# Altium schematic sheet EXPANSION_BOARD.SchDoc
size Tabloid; SheetNumber: 1; SheetTotal: 1; SPICEModelCacheOXJGALYG: <root> / <DocumentId>OXJGALYG</DocumentId> / <CacheFrame Number="0"> / <Model Name="0603_150060bs75003" Kind="CKT"> / <Text>****** / .subckt 0603_150060BS75003  1  2 / D1 1 2 SMCW / .MODEL SMCW D / + IS=695.94E-6 / + N=5 / + RS=2.4677 / + IKF=16.109E-12 / + CJO=1.0000E-12 / + M=.3333 / + VJ=.75 / + BV=5 / + IBV=10.00E-6 / + TT=5.0000E-9 / .ends</Text> / </Model> / <Model Name="0603_150060ys73220" Kind="CKT"> / <Text>********************************* / .subckt 0603_150060YS73220 1 2 / D1 1 2 SMCC / .MODEL SMCC D / + IS=405.27E-18 / + N=2.1772 / + RS=.76388 / + IKF=194.19E-6 / + CJO=1.0000E-12 / + M=.3333 / + VJ=.75 / + BV=5 / + IBV=100.00E-6 / + TT=5.0000E-9 / .ends</Text> / </Model> / <Model Name="0603_150060rs75003" Kind="CKT"> / <Text>****** / .subckt 0603_150060RS75003  1  2 / D1 1 2 SMCW / .MODEL SMCW D / + IS=1.0025E-15 / + N=2.2259 / + RS=.3926 / + IKF=240.91E-6 / + CJO=1.0000E-12 / + M=.3333 / + VJ=.75 / + BV=5 / + IBV=10.00E-6 / + TT=5.0000E-9 / .ends</Text> / </Model> / </CacheFrame> / </root>
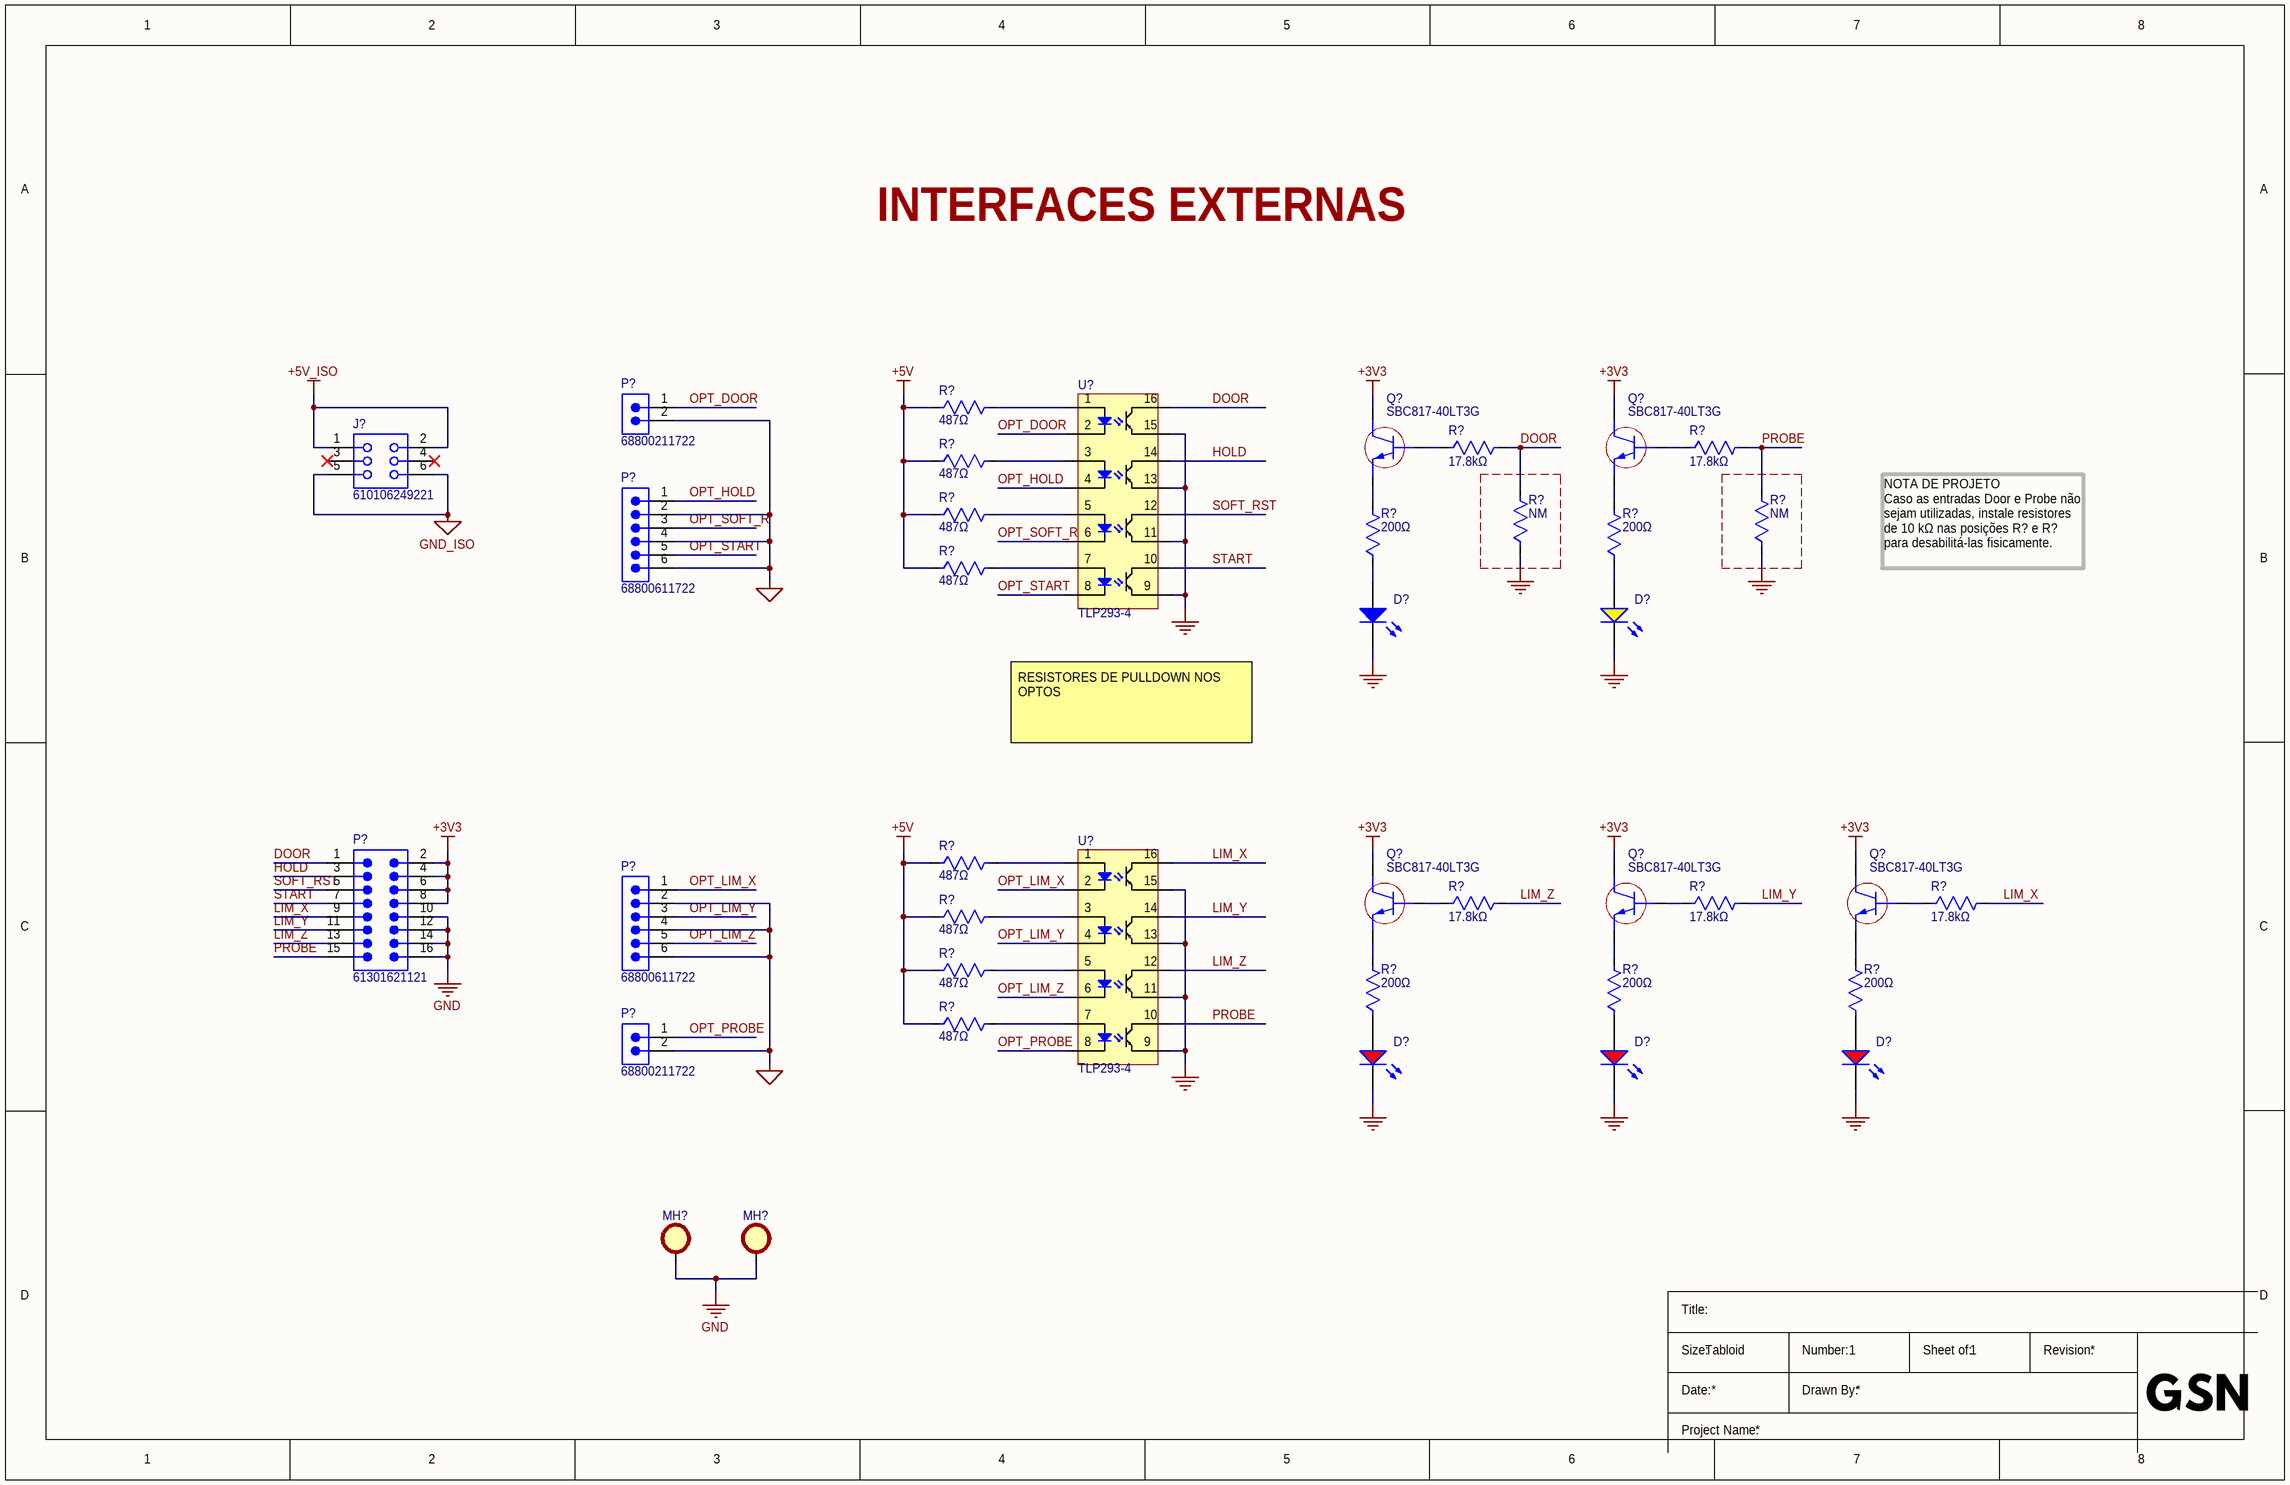
[diagram p0: EXPANSION_BOARD.SchDoc]

## Parts
(Parts that share a designator on the sheet are numbered #1, #2 ... from top to bottom, then left to right.)
D?#1  Blue, 3.2V, 140°  [WL-SMCW_0603_150060xx75003]  (value not drawn)
D?#2  Yellow, 2V, 120°  [WL-SMCC_0603_150060xx73220]  (value not drawn)
D?#3  Red, 2V, 140°  [WL-SMCW_0603_150060xx75003]  (value not drawn)
D?#4  Red, 2V, 140°  [WL-SMCW_0603_150060xx75003]  (value not drawn)
D?#5  Red, 2V, 140°  [WL-SMCW_0603_150060xx75003]  (value not drawn)
J?  610106249221  [610106249221]
MH?#1  Mounting Hole 2.5mm  [MOUNTING_HOLE_M2P5_PLATED]  (value not drawn)  (no BOM)
MH?#2  Mounting Hole 2.5mm  [MOUNTING_HOLE_M2P5_PLATED]  (value not drawn)  (no BOM)
P?#1  68800211722  [68800211722]
P?#2  68800611722  [68800611722]
P?#3  61301621121  [61301621121]
P?#4  68800611722  [68800611722]
P?#5  68800211722  [68800211722]
Q?#1  SBC817-40LT3G  [SOT-23-3]
Q?#2  SBC817-40LT3G  [SOT-23-3]
Q?#3  SBC817-40LT3G  [SOT-23-3]
Q?#4  SBC817-40LT3G  [SOT-23-3]
Q?#5  SBC817-40LT3G  [SOT-23-3]
R?#1  487Ω  [0603-REFLOW]
R?#2  17.8kΩ  [0603-WAVE]
R?#3  17.8kΩ  [0603-WAVE]
R?#4  487Ω  [0603-REFLOW]
R?#5  487Ω  [0603-REFLOW]
R?#6  NM  [0805-REFLOW]
R?#7  NM  [0805-REFLOW]
R?#8  487Ω  [0603-REFLOW]
R?#9  200Ω  [0603-REFLOW]
R?#10  200Ω  [0603-REFLOW]
R?#11  487Ω  [0603-REFLOW]
R?#12  17.8kΩ  [0603-WAVE]
R?#13  17.8kΩ  [0603-WAVE]
R?#14  17.8kΩ  [0603-WAVE]
R?#15  487Ω  [0603-REFLOW]
R?#16  487Ω  [0603-REFLOW]
R?#17  487Ω  [0603-REFLOW]
R?#18  200Ω  [0603-REFLOW]
R?#19  200Ω  [0603-REFLOW]
R?#20  200Ω  [0603-REFLOW]
U?#1  TLP293-4  [SO-16]
U?#2  TLP293-4  [SO-16]

## Nets
+3V3: P?#3.2 P?#3.4 P?#3.6 P?#3.8 Q?#1.3(C) Q?#2.3(C) Q?#3.3(C) Q?#4.3(C) Q?#5.3(C)
+5V: R?#1.1 R?#4.1 R?#5.1 R?#8.1 R?#11.1 R?#15.1 R?#16.1 R?#17.1
+5V_ISO: J?.1 J?.2
GND: D?#1.2(K) D?#2.1(K) D?#3.2(K) D?#4.2(K) D?#5.2(K) MH?#1.H MH?#2.H P?#3.10 P?#3.12 P?#3.14 P?#3.16 R?#6.1 R?#7.1 U?#1.9 U?#1.11 U?#1.13 U?#1.15 U?#2.9 U?#2.11 U?#2.13 U?#2.15
GND_ISO: J?.5 J?.6 P?#1.2 P?#2.2 P?#2.4 P?#2.6 P?#4.2 P?#4.4 P?#4.6 P?#5.2
DOOR: P?#3.1 R?#2.2 R?#6.2 U?#1.16
HOLD: P?#3.3 U?#1.14
LIM_X: P?#3.9 R?#14.2 U?#2.16
LIM_Y: P?#3.11 R?#13.2 U?#2.14
LIM_Z: P?#3.13 R?#12.2 U?#2.12
OPT_DOOR: P?#1.1 U?#1.2
OPT_HOLD: P?#2.1 U?#1.4
OPT_LIM_X: P?#4.1 U?#2.2
OPT_LIM_Y: P?#4.3 U?#2.4
OPT_LIM_Z: P?#4.5 U?#2.6
OPT_PROBE: P?#5.1 U?#2.8
OPT_SOFT_R: P?#2.3 U?#1.6
OPT_START: P?#2.5 U?#1.8
PROBE: P?#3.15 R?#3.2 R?#7.2 U?#2.10
SOFT_RST: P?#3.5 U?#1.12
START: P?#3.7 U?#1.10
NetD?#1_1: D?#1.1(A) R?#9.1
NetD?#2_2: D?#2.2(A) R?#10.1
NetD?#3_1: D?#3.1(A) R?#18.1
NetD?#4_1: D?#4.1(A) R?#19.1
NetD?#5_1: D?#5.1(A) R?#20.1
NetQ?#1_1: Q?#1.1(B) R?#2.1
NetQ?#1_2: Q?#1.2(E) R?#9.2
NetQ?#2_1: Q?#2.1(B) R?#3.1
NetQ?#2_2: Q?#2.2(E) R?#10.2
NetQ?#3_1: Q?#3.1(B) R?#12.1
NetQ?#3_2: Q?#3.2(E) R?#18.2
NetQ?#4_1: Q?#4.1(B) R?#13.1
NetQ?#4_2: Q?#4.2(E) R?#19.2
NetQ?#5_1: Q?#5.1(B) R?#14.1
NetQ?#5_2: Q?#5.2(E) R?#20.2
NetR?#1_2: R?#1.2 U?#1.1
NetR?#4_2: R?#4.2 U?#1.3
NetR?#5_2: R?#5.2 U?#1.5
NetR?#8_2: R?#8.2 U?#1.7
NetR?#11_2: R?#11.2 U?#2.1
NetR?#15_2: R?#15.2 U?#2.3
NetR?#16_2: R?#16.2 U?#2.5
NetR?#17_2: R?#17.2 U?#2.7

Not connected (* = marked no-connect by the designer): J? 3* 4*

## Notes on the sheet
- INTERFACES EXTERNAS
- NOTA DE PROJETO
  Caso as entradas Door e Probe não sejam utilizadas, instale resistores de 10 kΩ nas posições R? e R? para desabilitá-las fisicamente.
- RESISTORES DE PULLDOWN NOS OPTOS
- Title:
- Size:
- Tabloid
- Number:
- Sheet of:
- Revision:
- Date:
- Project Name:
- Drawn By:

## Library data of the parts
D?#1 = 150060BS75003: WL-SMCW Mono-color Chip LED Waterclear, SMT, size 0603, Blue, 3.2V, 140°; Manufacturer: Wurth Elektronik; Case/Size Code: 0603; Chip Technology: InGaN; Dominant Wavelength: 470nm; Luminous Intensity: 350mcd; Peak Wavelength: 465nm; Manufacturer Part Number: 150060BS75003; Category: Signal LEDs; Match Code: WL-SMCW; ComponentLink1Description: Website Link; ComponentLink1URL: https://www.we-online.com/redexpert/article/150060BS75003?ad; ComponentLink2Description: Datasheet Link; ComponentLink2URL: https://www.we-online.com/redexpert/spec/150060BS75003?ad; Mount: Surface Mount; Min Operating Temperature: -40°C; Max Operating Temperature: 100°C; Packaging: Tape and Reel; Length: 1.6mm; Width: 0.8mm; Height: 0.7mm; Emitting Color: Blue; Forward Voltage: 3.2V; Viewing Angle: 140°
D?#2 = 150060YS73220: WL-SMCC Mono-color Chip LED Compact, SMT, size 0603, Yellow, 2V, 120°; Manufacturer: Wurth Elektronik; Case/Size Code: 0603; Chip Technology: AlInGaP; Dominant Wavelength: 589nm; Luminous Intensity: 100mcd; Peak Wavelength: 591nm; Manufacturer Part Number: 150060YS73220; Category: Signal LEDs; Match Code: WL-SMCC; ComponentLink1Description: Website Link; ComponentLink1URL: https://www.we-online.com/redexpert/article/150060YS73220?ad; ComponentLink2Description: Datasheet Link; ComponentLink2URL: https://www.we-online.com/redexpert/spec/150060YS73220?ad; Mount: Surface Mount; Min Operating Temperature: -40°C; Max Operating Temperature: 85°C; Packaging: Tape and Reel; Length: 1.6mm; Width: 0.8mm; Height: 0.2mm; Emitting Color: Yellow; Forward Voltage: 2V; Viewing Angle: 120°
D?#3-D?#5 = 150060RS75003: WL-SMCW Mono-color Chip LED Waterclear, SMT, size 0603, Red, 2V, 140°; Manufacturer: Wurth Elektronik; Case/Size Code: 0603; Chip Technology: AlInGaP; Dominant Wavelength: 625nm; Luminous Intensity: 530mcd; Peak Wavelength: 630nm; Manufacturer Part Number: 150060RS75003; Category: Signal LEDs; Match Code: WL-SMCW; ComponentLink1Description: Website Link; ComponentLink1URL: https://www.we-online.com/redexpert/article/150060RS75003?ad; ComponentLink2Description: Datasheet Link; ComponentLink2URL: https://www.we-online.com/redexpert/spec/150060RS75003?ad; Mount: Surface Mount; Min Operating Temperature: -40°C; Max Operating Temperature: 100°C; Packaging: Tape and Reel; Length: 1.6mm; Width: 0.8mm; Height: 0.7mm; Emitting Color: Red; Forward Voltage: 2V; Viewing Angle: 140°
J? = 610106249221: WR-PHD Socket Header, SMT, Angled, pitch 2.54mm, 2 Row, 6P; Manufacturer: Wurth Elektronik; Contact Resistance: 20mOhm; Rated Current: 3A; Working Voltage: 250V; Withstanding Voltage: 600V; Manufacturer Part Number: 610106249221; Category: Board-to-Board Connectors; Match Code: WR-PHD; ComponentLink1Description: Website Link; ComponentLink1URL: https://www.we-online.com/redexpert/article/610106249221?ad; ComponentLink2Description: Datasheet Link; ComponentLink2URL: https://www.we-online.com/redexpert/spec/610106249221?ad; Mount: Surface Mount; Operating Temperature Min: -40degC; Operating Temperature Max: 105degC; Packaging: Tape and Reel; Gender: Socket Header; Number of Pins: 6; Number of Rows: 2; Orientation: Angled; Lead Pitch: 2.54mm
MH?#1 MH?#2 = MTH-2P5MM-PLATED: PLATED MOUNTING HOLE WITH 2.5MM DIAMETER
P?#1 P?#5 = 68800211722: WR-WTB “J” Type THT Male Horizontal Shrouded Header, pitch 2.5 mm, 2 pins; Manufacturer: Wurth Elektronik; Contact Resistance: 20 mohm; Rated Current: 3 A; Working Voltage: 250 V(AC); Withstanding Voltage: 800 V(AC); Manufacturer Part Number: 68800211722; Category: Wire-to-Board Connector; Match Code: WR-WTB; ComponentLink1Description: Website Link; ComponentLink1URL: https://www.we-online.com/redexpert/article/68800211722?ad; ComponentLink2Description: Datasheet Link; ComponentLink2URL: https://www.we-online.com/redexpert/spec/68800211722?ad; Mount: Through Hole; Operating Temperature Min: -25degC; Operating Temperature Max: 85degC; Packaging: Bag; Length: 7.5 mm; Width: 8.3 mm; Height: 4.2 mm; Gender: Male; Number of Pins: 2; Number of Rows: 1; Orientation: Horizontal; Lead Pitch: 2.5 mm
P?#2 P?#4 = 68800611722: WR-WTB “J” Type THT Male Horizontal Shrouded Header, pitch 2.5 mm, 6 pins; Manufacturer: Wurth Elektronik; Contact Resistance: 20 mohm; Rated Current: 3 A; Working Voltage: 250 V(AC); Withstanding Voltage: 800 V(AC); Manufacturer Part Number: 68800611722; Category: Wire-to-Board Connector; Match Code: WR-WTB; ComponentLink1Description: Website Link; ComponentLink1URL: https://www.we-online.com/redexpert/article/68800611722?ad; ComponentLink2Description: Datasheet Link; ComponentLink2URL: https://www.we-online.com/redexpert/spec/68800611722?ad; Mount: Through Hole; Operating Temperature Min: -25degC; Operating Temperature Max: 85degC; Packaging: Bag; Length: 17.5 mm; Width: 8.3 mm; Height: 4.2 mm; Gender: Male; Number of Pins: 6; Number of Rows: 1; Orientation: Horizontal; Lead Pitch: 2.5 mm
P?#3 = 61301621121: WR-PHD Pin Header, THT, Vertical, pitch 2.54mm, 2 Row, 16P; Manufacturer: Wurth Elektronik; Contact Resistance: 20mOhm; Rated Current: 3A; Working Voltage: 250V; Withstanding Voltage: 500V; Manufacturer Part Number: 61301621121; Category: Board-to-Board Connectors; Match Code: WR-PHD; ComponentLink1Description: Website Link; ComponentLink1URL: https://www.we-online.com/redexpert/article/61301621121?ad; ComponentLink2Description: Datasheet Link; ComponentLink2URL: https://www.we-online.com/redexpert/spec/61301621121?ad; Mount: Through Hole; Operating Temperature Min: -40degC; Operating Temperature Max: 105degC; Packaging: Bag; Gender: Pin Header; Number of Pins: 16; Number of Rows: 2; Orientation: Vertical; Lead Pitch: 2.54mm
Q?#1-Q?#5 = SBC817-40LT3G: TRANS NPN 45V 0.5A SOT23-3; Manufacturer: onsemi; Manufacturer Lifecycle Status: ACTIVE; Collector Base Voltage (VCBO): 50V; Continuous Collector Current: 500mA; Element Configuration: Single; Emitter Base Voltage (VEBO): 5V; Frequency: 100MHz; hFE Min: 250; Max Power Dissipation: 300mW; Number of Elements: 1; Supplier: DigiKey; Supplier Part Number: SBC817-40LT3GOSCT-ND; Manufacturer Part Number: SBC817-40LT3G; RoHS: Compliant; Category: BJTs; Stock: 144045; Pricing: 1=0.24, 10=0.146, 100=0.0904, 500=0.06616, 1000=0.05829, 2000=0.05165, 5000=0.04443 (USD); Case/Package: SOT-23-3; China RoHS: Compliant; Collector Emitter Breakdown Voltage: 45V; Collector Emitter Voltage (VCEO): 45V; Country of Origin: Mainland China; Export Control Classification Number (ECCN) Code: EAR99; Halogen Free: Halogen Free; Introduction Date: 1991-03-01; Lead Free: Lead Free; Lifecycle Status: Production; Max Breakdown Voltage: 45V; Max Collector Current: 500mA; Clock Frequency: 100MHz; Max Operating Temperature: 150°C; Min Operating Temperature: -55°C; Pins: 3; Number of Terminals: 3; Packaging: Tape and Reel; Polarity: NPN; Power Dissipation: 300mW; Radiation Hardening: No; REACH SVHC: Yes; Schedule B: 8541210080, 8541210080|8541210080, 8541210080|8541210080|8541210080, 8541210080|8541210080|8541210080|8541210080; Transition Frequency: 100MHz; ComponentLink1URL: https://datasheet.octopart.com:443/SBC817-40LT3G-onsemi-datasheet-175914671.pdf?src-supplier=IHS; ComponentLink1Description: https://datasheet.octopart.com:443/SBC817-40LT3G-onsemi-datasheet-175914671.pdf?src-supplier=IHS; ComponentLink2URL: https://datasheet.octopart.com:443/SBC817-40LT3G-ON-Semiconductor-datasheet-11547464.pdf?src-supplier=Upverter; ComponentLink2Description: https://datasheet.octopart.com:443/SBC817-40LT3G-ON-Semiconductor-datasheet-11547464.pdf?src-supplier=Upverter; ComponentLink3URL: https://datasheet.octopart.com:443/SBC817-40LT3G-ON-Semiconductor-datasheet-78758879.pdf?src-supplier=Master+Electronics; ComponentLink3Description: https://datasheet.octopart.com:443/SBC817-40LT3G-ON-Semiconductor-datasheet-78758879.pdf?src-supplier=Master+Electronics; ComponentLink4URL: https://datasheet.octopart.com:443/SBC817-40LT3G-onsemi-datasheet-189132499.pdf?src-supplier=Master+Electronics; ComponentLink4Description: https://datasheet.octopart.com:443/SBC817-40LT3G-onsemi-datasheet-189132499.pdf?src-supplier=Master+Electronics; ComponentLink5URL: https://datasheet.octopart.com:443/SBC817-40LT3G-ON-Semiconductor-datasheet-8110464.pdf?src-supplier=onsemi; ComponentLink5Description: https://datasheet.octopart.com:443/SBC817-40LT3G-ON-Semiconductor-datasheet-8110464.pdf?src-supplier=onsemi; ComponentLink6URL: https://datasheet.octopart.com:443/SBC817-40LT3G-ON-Semiconductor-datasheet-6400296.pdf?src-supplier=onsemi; ComponentLink6Description: https://datasheet.octopart.com:443/SBC817-40LT3G-ON-Semiconductor-datasheet-6400296.pdf?src-supplier=onsemi; ComponentLink7URL: https://datasheet.octopart.com:443/SBC817-40LT3G-onsemi-datasheet-133521192.pdf?src-supplier=TME; ComponentLink7Description: https://datasheet.octopart.com:443/SBC817-40LT3G-onsemi-datasheet-133521192.pdf?src-supplier=TME; ComponentLink8URL: http://sigma.octopart.com:80/15540786/rohs_certificate/ON-Semiconductor-SBC817-40LT3G.pdf?src-supplier=Compliance+Statements; ComponentLink8Description: http://sigma.octopart.com:80/15540786/rohs_certificate/ON-Semiconductor-SBC817-40LT3G.pdf?src-supplier=Compliance+Statements; ComponentLink9URL: http://sigma.octopart.com:80/15684525/materials_sheet/ON-Semiconductor-SBC817-40LT3G.csv?src-supplier=Compliance+Statements; ComponentLink9Description: http://sigma.octopart.com:80/15684525/materials_sheet/ON-Semiconductor-SBC817-40LT3G.csv?src-supplier=Compliance+Statements; ComponentLink10URL: http://sigma.octopart.com:80/150631289/rohs_statement/ON-Semiconductor-SBC817-40LT3G.pdf?src-supplier=Compliance+Statements; ComponentLink10Description: http://sigma.octopart.com:80/150631289/rohs_statement/ON-Semiconductor-SBC817-40LT3G.pdf?src-supplier=Compliance+Statements; ComponentLink11URL: http://sigma.octopart.com:80/reach_statement/ON-Semiconductor-company-79.pdf?src-supplier=Compliance+Statements; ComponentLink11Description: http://sigma.octopart.com:80/reach_statement/ON-Semiconductor-company-79.pdf?src-supplier=Compliance+Statements; ComponentLink12URL: https://octopart.com:443/opatz8j6/c1?t=cEC30QwZsyb0x-FMX1jhecc8cj0lODbyQVaJL5I4EOudI-i4uiyo8QJe7x8WGpb_UfldyhXdI6wTsOpeJ5HWz7Kzleo1EiYpUhSwBawIenFlUCJsMQESd9nlIcVrbvWrabnb6HpXCtvxDkswRDKZDOG3MBWymJDy-mDPZ7u5UlptsX8-ONvWANeBowi-w7nz9iZWLyjqVoM_QTKEQgTILpDidA8CXVyMync_ukwLaadxciX7hbgDafM4N20bPQPEg7z2Sm1KwG15cEibpJqtQ1hKuQpn-edZc_o2ddvdnsTvT3gddPA_45tVxaNa9XWOJj00WFdTbgFSlU6TTFEybWVRRlK52823bHwN5uVZ-7M&src-supplier=Compliance+Statements; ComponentLink12Description: https://octopart.com:443/opatz8j6/c1?t=cEC30QwZsyb0x-FMX1jhecc8cj0lODbyQVaJL5I4EOudI-i4uiyo8QJe7x8WGpb_UfldyhXdI6wTsOpeJ5HWz7Kzleo1EiYpUhSwBawIenFlUCJsMQESd9nlIcVrbvWrabnb6HpXCtvxDkswRDKZDOG3MBWymJDy-mDPZ7u5UlptsX8-ONvWANeBowi-w7nz9iZWLyjqVoM_QTKEQgTILpDidA8CXVyMync_ukwLaadxciX7hbgDafM4N20bPQPEg7z2Sm1KwG15cEibpJqtQ1hKuQpn-edZc_o2ddvdnsTvT3gddPA_45tVxaNa9XWOJj00WFdTbgFSlU6TTFEybWVRRlK52823bHwN5uVZ-7M&src-supplier=Compliance+Statements; ComponentLink13URL: https://octopart.com:443/opatz8j6/c1?t=zgMoQUE-FAGizIL2uNADbP3CQfJXduVKNLOt0cT-C7XNOnl5EOgq1b4UVzb0SZjomH3a3CKF513mPEsnVuWFTldNModuoiOAROM-U7UMjU1TiA4JeYDoVNfia-psQDQPr2NtqLaOU9Ju06PrsXVFYjz3NjgsSVJa-5X9CcWQ1HPxPGGUjhKccWy9QJVPTcefUdorkFOZvdb3XFmpP_42jgzyR9ZUQAURqjwANTg96Z5ittV_NTML0IEyFPhh0jLh0am3ICJpb8VA9ph6AsqLc9j4fhdilqUiQTpG4UGLijUcgX0mpfEUR-9G0JRIiKjoFhJPWB3BEKd5JcwsK41biiNJ-0hjTcgtgsqlWYFFTPLS&src-supplier=Compliance+Statements; ComponentLink13Description: https://octopart.com:443/opatz8j6/c1?t=zgMoQUE-FAGizIL2uNADbP3CQfJXduVKNLOt0cT-C7XNOnl5EOgq1b4UVzb0SZjomH3a3CKF513mPEsnVuWFTldNModuoiOAROM-U7UMjU1TiA4JeYDoVNfia-psQDQPr2NtqLaOU9Ju06PrsXVFYjz3NjgsSVJa-5X9CcWQ1HPxPGGUjhKccWy9QJVPTcefUdorkFOZvdb3XFmpP_42jgzyR9ZUQAURqjwANTg96Z5ittV_NTML0IEyFPhh0jLh0am3ICJpb8VA9ph6AsqLc9j4fhdilqUiQTpG4UGLijUcgX0mpfEUR-9G0JRIiKjoFhJPWB3BEKd5JcwsK41biiNJ-0hjTcgtgsqlWYFFTPLS&src-supplier=Compliance+Statements
R?#1 R?#4 R?#5 R?#8 R?#11 R?#15-R?#17 = RC0603FR-07487RL: RES 487 OHM 1% 1/10W 0603; Manufacturer: Yageo Group; Max Power Dissipation: 100mW; Temperature Coefficient: ±200ppm/°C; Voltage Rating (AC): 50V; Voltage Rating: 75V; Supplier Part Number: 311-487HRCT-ND; Manufacturer Part Number: RC0603FR-07487RL; Value: 487Ω; Case Code (Imperial): 0603; Case Code (Metric): 1608; Case/Package: 0603; Category: Chip SMD Resistors; China RoHS: Non-Compliant; Composition: Thick Film; Contact Plating: Tin; Depth: 800µm; Features: Moisture Resistant; Height: 450µm; Lead Free: Lead Free; Length: 1.6mm; Lifecycle Status: Production; Max Operating Temperature: 155°C; Military Standard: Not; Min Operating Temperature: -55°C; Mounting Technology: Surface Mount; Number of Terminals: 2; Number of Terminations: 2; Packaging: Tape & Reel; Power Dissipation: 100mW; Power Rating: 100mW; Radiation Hardening: No; REACH SVHC: Yes; RoHS: Compliant; Supplier: DigiKey; Termination: SMD/SMT; Tolerance: 1%; Component Link Description: https://www.yageogroup.com/content/datasheet/asset/file/PYU-RC_GROUP_51_ROHS_L; Component Link URL: https://www.yageogroup.com/content/datasheet/asset/file/PYU-RC_GROUP_51_ROHS_L; Datasheet: https://www.yageogroup.com/content/datasheet/asset/file/PYU-RC_GROUP_51_ROHS_L; Voltage Rating (DC): 50V; Weight: 2.012816mg; Width: 800µm; Working Voltage: 75V
R?#2 R?#3 R?#12-R?#14 = RC0603FR-0717K8L: RES 17.8K OHM 1% 1/10W 0603; Manufacturer: Yageo Group; Max Power Dissipation: 100mW; Temperature Coefficient: ±200ppm/°C; Voltage Rating (AC): 50V; Voltage Rating: 75V; Supplier Part Number: 311-17.8KHRCT-ND; Manufacturer Part Number: RC0603FR-0717K8L; Value: 17.8kΩ; Case Code (Imperial): 0603; Case Code (Metric): 1608; Case/Package: 0603; Category: Chip SMD Resistors; China RoHS: Non-Compliant; Composition: Thick Film; Contact Plating: Tin; Depth: 800µm; Features: Moisture Resistant; Height: 450µm; Lead Free: Lead Free; Length: 1.6mm; Lifecycle Status: Production; Max Operating Temperature: 155°C; Military Standard: Not; Min Operating Temperature: -55°C; Mounting Technology: Surface Mount; Number of Terminals: 2; Number of Terminations: 2; Packaging: Tape & Reel; Power Dissipation: 100mW; Power Rating: 100mW; Radiation Hardening: No; REACH SVHC: Yes; RoHS: Compliant; Supplier: DigiKey; Termination: SMD/SMT; Tolerance: 1%; Component Link Description: https://www.yageogroup.com/content/datasheet/asset/file/PYU-RC_GROUP_51_ROHS_L; Component Link URL: https://www.yageogroup.com/content/datasheet/asset/file/PYU-RC_GROUP_51_ROHS_L; Datasheet: https://www.yageogroup.com/content/datasheet/asset/file/PYU-RC_GROUP_51_ROHS_L; Voltage Rating (DC): 50V; Weight: 2.012816mg; Width: 800µm; Working Voltage: 75V
R?#6 R?#7 = RC0805FR-070RL: RES 0 OHM 1% 1/8W 0805; Manufacturer: Yageo Group; Power Dissipation: 125mW; Value: 0Ω; Temperature Coefficient: 100ppm/°C; Voltage Rating: 150V; Supplier: DigiKey; Supplier Part Number: 311-0.0CRCT-ND; Manufacturer Part Number: RC0805FR-070RL; RoHS: Compliant; Category: Chip SMD Resistors; Stock: 748818; Pricing: 1=0.1, 10=0.017, 25=0.0144, 50=0.0124, 100=0.0109, 250=0.00916, 500=0.00808, 1000=0.00715 (USD); Case/Package: 0805; China RoHS: Non-Compliant; Composition: Thick Film; Contact Plating: Tin; Depth: 1.25mm; Height: 500µm; Lead Free: Lead Free; Length: 2mm; Lifecycle Status: Production; Max Operating Temperature: 155°C; Military Standard: Not; Min Operating Temperature: -55°C; Mounting Technology: Surface Mount; Number of Terminals: 2; Power Rating: 125mW; Radiation Hardening: No; REACH SVHC: Yes; Tolerance: 1%; Width: 1.25mm; ComponentLink1URL: https://datasheet.octopart.com:443/RC0805FR-070RL-Yageo-datasheet-127823281.pdf?src-supplier=Upverter; ComponentLink1Description: https://datasheet.octopart.com:443/RC0805FR-070RL-Yageo-datasheet-127823281.pdf?src-supplier=Upverter; ComponentLink2URL: https://datasheet.octopart.com:443/RC0805FR-070RL-Yageo-datasheet-17879891.pdf?src-supplier=IHS; ComponentLink2Description: https://datasheet.octopart.com:443/RC0805FR-070RL-Yageo-datasheet-17879891.pdf?src-supplier=IHS; ComponentLink3URL: https://datasheet.octopart.com:443/RC0805FR-070RL-Yageo-datasheet-8330313.pdf?src-supplier=Burklin+Elektronik; ComponentLink3Description: https://datasheet.octopart.com:443/RC0805FR-070RL-Yageo-datasheet-8330313.pdf?src-supplier=Burklin+Elektronik; ComponentLink4URL: https://datasheet.octopart.com:443/RC0805FR-070RL-Yageo-datasheet-164759695.pdf?src-supplier=Future+Electronics; ComponentLink4Description: https://datasheet.octopart.com:443/RC0805FR-070RL-Yageo-datasheet-164759695.pdf?src-supplier=Future+Electronics; ComponentLink5URL: https://datasheet.octopart.com:443/RC0805FR-070RL-Yageo-datasheet-12592811.pdf?src-supplier=Future+Electronics; ComponentLink5Description: https://datasheet.octopart.com:443/RC0805FR-070RL-Yageo-datasheet-12592811.pdf?src-supplier=Future+Electronics; ComponentLink6URL: https://datasheet.octopart.com:443/RC0805FR-070RL-Yageo-datasheet-8324252.pdf?src-supplier=Future+Electronics; ComponentLink6Description: https://datasheet.octopart.com:443/RC0805FR-070RL-Yageo-datasheet-8324252.pdf?src-supplier=Future+Electronics; ComponentLink7URL: https://datasheet.octopart.com:443/RC0805FR-070RL-Yageo-datasheet-141265859.pdf?src-supplier=TME; ComponentLink7Description: https://datasheet.octopart.com:443/RC0805FR-070RL-Yageo-datasheet-141265859.pdf?src-supplier=TME; ComponentLink8URL: https://datasheet.octopart.com/RC0805FR-070RL-Yageo-datasheet-73766026.pdf; ComponentLink8Description: https://datasheet.octopart.com/RC0805FR-070RL-Yageo-datasheet-73766026.pdf; ComponentLink9URL: http://sigma.octopart.com:80/conflict_mineral_statement/Yageo-company-3.pdf?src-supplier=Compliance+Statements; ComponentLink9Description: http://sigma.octopart.com:80/conflict_mineral_statement/Yageo-company-3.pdf?src-supplier=Compliance+Statements; ComponentLink10URL: http://sigma.octopart.com:80/rohs_statement/Yageo-company-2.pdf?src-supplier=Compliance+Statements; ComponentLink10Description: http://sigma.octopart.com:80/rohs_statement/Yageo-company-2.pdf?src-supplier=Compliance+Statements
R?#9 R?#10 R?#18-R?#20 = RC0603FR-07200RL: RES 200 OHM 1% 1/10W 0603; Manufacturer: Yageo Group; Max Power Dissipation: 100mW; Temperature Coefficient: ±200ppm/°C; Voltage Rating (AC): 50V; Voltage Rating: 75V; Supplier Part Number: 311-200HRCT-ND; Manufacturer Part Number: RC0603FR-07200RL; Value: 200Ω; Case Code (Imperial): 0603; Case Code (Metric): 1608; Case/Package: 0603; Category: Chip SMD Resistors; China RoHS: Non-Compliant; Composition: Thick Film; Contact Plating: Tin; Depth: 800µm; Features: Moisture Resistant; Height: 450µm; Lead Free: Lead Free; Length: 1.6mm; Lifecycle Status: Production; Max Operating Temperature: 155°C; Military Standard: Not; Min Operating Temperature: -55°C; Mounting Technology: Surface Mount; Number of Terminals: 2; Number of Terminations: 2; Packaging: Tape & Reel; Power Dissipation: 100mW; Power Rating: 100mW; Radiation Hardening: No; REACH SVHC: Yes; RoHS: Compliant; Supplier: DigiKey; Termination: SMD/SMT; Tolerance: 1%; Component Link Description: https://www.yageogroup.com/content/datasheet/asset/file/PYU-RC_GROUP_51_ROHS_L; Component Link URL: https://www.yageogroup.com/content/datasheet/asset/file/PYU-RC_GROUP_51_ROHS_L; Datasheet: https://www.yageogroup.com/content/datasheet/asset/file/PYU-RC_GROUP_51_ROHS_L; Voltage Rating (DC): 50V; Weight: 2.012816mg; Width: 800µm; Working Voltage: 75V
U?#1 U?#2 = TLP293-4: OPTOISO 3.75KV 4CH TRANS 16-SO; Manufacturer: Toshiba; Manufacturer Part Number: TLP293-4(TP,E; Collector Emitter Breakdown Voltage: 80V; Collector Emitter Saturation Voltage: 300mV; Current Transfer Ratio: 50%; Dark Current: 80nA; Forward Current: 50mA; Forward Voltage: 1.4V; Max Junction Temperature (Tj): 125°C; Max Power Dissipation: 100mW; Number of Channels: 4; Turn-Off Delay Time: 3µs; Supplier: DigiKey; Supplier Part Number: TLP293-4(TPECT-ND; RoHS: Compliant; Category: Optocouplers; Stock: 42408; Pricing: 1=1.54, 10=1.093, 100=0.8233, 500=0.704, 1000=0.66505 (USD); Case/Package: SOIC; Collector Emitter Voltage (VCEO): 300mV; Height: 2.3mm; Isolation Voltage: 3.75kV; Lifecycle Status: Production; Max Operating Temperature: 125°C; Max Output Voltage: 80V; Min Operating Temperature: -55°C; Mounting Technology: Surface Mount; Number of Elements: 4; Pins: 16; Output Current per Channel: 50mA; Packaging: Tape & Reel (TR); REACH SVHC: Yes; Schedule B: 8541408000, 8541408000|8541408000|8541408000|8541408000|8541408000; Turn-On Delay Time: 3µs; ComponentLink1URL: https://datasheet.octopart.com:443/TLP293-4%28TP%2CE-Toshiba-datasheet-165584699.pdf?src-supplier=IHS; ComponentLink1Description: https://datasheet.octopart.com:443/TLP293-4%28TP%2CE-Toshiba-datasheet-165584699.pdf?src-supplier=IHS; ComponentLink2URL: https://datasheet.octopart.com:443/TLP293-4%28TP%2CE-Toshiba-datasheet-62096132.pdf?src-supplier=Upverter; ComponentLink2Description: https://datasheet.octopart.com:443/TLP293-4%28TP%2CE-Toshiba-datasheet-62096132.pdf?src-supplier=Upverter